# EAGLE design dcmotor (EAGLE 9.6.2)
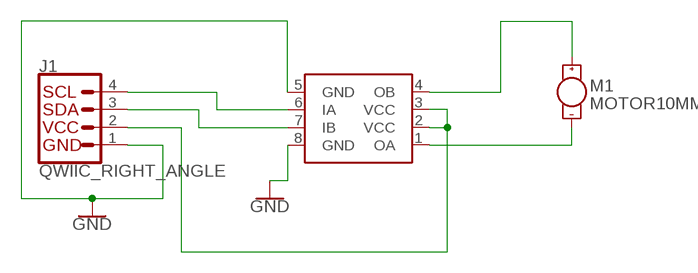
[diagram p0: schematic, sheet 1]

## Parts
J1  QWIIC_RIGHT_ANGLE  QWIIC_CONNECTORJS-1MM  [JST04_1MM_RA]
M1  MOTOR10MM  [VIBE-MOTOR-10MM]
U$1  L9110SO8  [SO-08]

## Nets
GND: J1.1 U$1.5(GND) U$1.8(GND)
N$1: M1.+ U$1.4(OB)
N$2: M1.- U$1.1(OA)
N$3: J1.4 U$1.6(IA)
N$4: J1.3 U$1.7(IB)
N$7: J1.2 U$1.2(VCC) U$1.3(VCC)

## Library data of the parts
J1 = SparkFun-Connectors:QWIIC_CONNECTOR: SparkFun I2C Standard Qwiic Connector An SMD 1mm pitch JST connector makes it easy and quick (get it? Qwiic?) to connect I2C devices to each other. The Qwiic system <http://www.sparkfun.com/qwiic> enables fast and solderless connection between popular platforms and various sensors and actuators. We carry 200mm <https://www.sparkfun.com/products/14204>, 100mm <https://www.sparkfun.com/products/14205>, 50mm <https://www.sparkfun.com/products/14206>, and breadboard friendly <https://www.sparkfun.com/products/14207> Qwiic cables. We also offer 10 pcs strips <https://www.sparkfun.com/products/14323> the SMD connectors.; PROD_ID: CONN-13694
M1 = SparkFun-Electromechanical:MOTOR: Motor (Single-Phase) Two-terminal, single-phase motors. SparkFun Products Vibration Motor <https://www.sparkfun.com/products/8449> (ROB-08449) Physical dimension and wire connections for this powerful vibration motor. Motor has a self adhesive backing.; PROD_ID: COMP-08572; SF_SKU: ROB-08449
U$1 = L9110:L9110: Check availability <https://pricing.snapeda.com/parts/L9110%20%28SOP-8%29/Asic/view-part?ref=eda>; AVAILABILITY: Not in stock; DESCRIPTION: Motor control driver chip; MF: Asic; MP: L9110 (SOP-8); PACKAGE: Package; PRICE: None

## Board
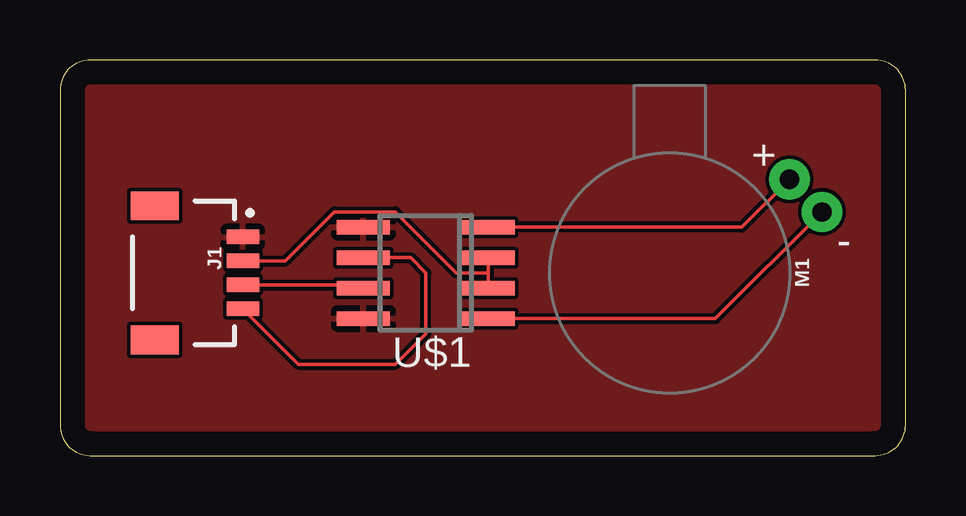
[diagram p1: board, top side]

Size 35.23 x 16.5 mm. Coordinates in mm from the lower left corner, seen from the top.
Outline: 0,15.23 0,1.27 arc90 1.27,0 33.96,0 arc90 35.23,1.27 35.23,15.23 arc90 33.96,16.5 1.27,16.5 arc90 0,15.23
Copper layers (1*16): Top 0.035mm / dielectric 1.5mm / Bottom 0.035mm
Design rules "default": minimum track width 6mil, minimum drill 0.35mm, track to track 6mil, track to pad 6mil, pad to pad 6mil, via to via 6mil, smd to smd 6mil, copper to edge 40mil, drill to drill 6mil, minimum pad ring 10mil, minimum via ring 8mil, stop-mask expansion 4mil, vias tented up to drill 0mil, thermal gap 10mil

### Footprints (pad centres in the part's own frame; a part is rotated, then mirrored left to right if it is on the bottom)
JST04_1MM_RA = smd 0.6 x 1.35: 1 -1.5,0; 2 -0.5,0; 3 0.5,0; 4 1.5,0 | smd 1.2 x 2: NC1 2.8,-3.675; NC2 -2.8,-3.675
VIBE-MOTOR-10MM = drill 0.8 pad 1.676: + -5,-3.9; - -6.35,-2.54
SO-08 = smd 0.6 x 2.2: 1 -1.905,-2.6; 2 -0.635,-2.6; 3 0.635,-2.6; 4 1.905,-2.6; 5 1.905,2.6; 6 0.635,2.6; 7 -0.635,2.6; 8 -1.905,2.6

### Placement (x,y rotation side)
J1  7.62,7.62 270 top
M1  25.4,7.62 180 top
U$1  15.24,7.62 90 top

### Tracks (layer width: path | path; a pad name or v marks a point on that pad's centre or on a via)
GND
  pour Top: 1.27,16.51 34.29,16.51 arc-90 35.56,15.24 35.56,1.27 arc-90 34.29,0 1.27,0 arc-90 0,1.27 0,15.24 arc-90
N$1
  Top 0.152: U$1.4 19.05,9.53 28.41,9.53 M1.+
N$2
  Top 0.152: U$1.1 27.3,5.72 M1.-
N$3
  Top 0.152: 7.85,6.35 J1.4 9.93,3.81 13.97,3.81 15.24,5.08 15.24,7.62 14.61,8.26 U$1.6
N$4
  Top 0.152: U$1.7 12.51,7.12 J1.3
N$7
  Top 0.152: U$1.3 17.84,7.62 | 17.84,7.62 U$1.2 | J1.2 9.39,8.12 11.43,10.16 13.97,10.16 16.51,7.62 17.84,7.62